# Altium schematic sheet POWER_IN.SchDoc
size A4
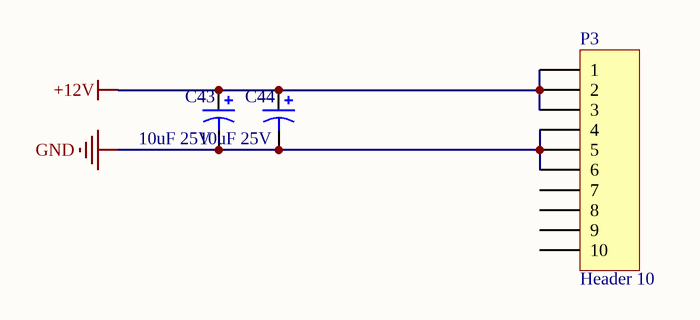
[diagram p0: POWER_IN.SchDoc]

## Parts
C43  value 10uF 25V  [470UF_16V]  (hidden comment: Cap Pol1)
C44  value 10uF 25V  [470UF_16V]  (hidden comment: Cap Pol1)
P3  Header 10  [CON_MOL_5569_6P]

## Nets
+12V: C43.1 C44.1 P3.1 P3.2 P3.3
GND: C43.2 C44.2 P3.4 P3.5 P3.6

Not connected (* = marked no-connect by the designer): P3 7 8 9 10

## Library data of the parts
C43 C44 = Cap Pol1: Polarized Capacitor (Radial); Published: 8-Jun-2000; LatestRevisionDate: 17-Jul-2002; LatestRevisionNote: Re-released for DXP Platform.; PackageReference: RB7.6-15; Publisher: Altium Limited; PackageDescription: Polarized Capacitor (Radial); 2 Leads
P3 = Header 10: Header, 10-Pin; LatestRevisionDate: 17-Jul-2002; LatestRevisionNote: Re-released for DXP Platform.; Publisher: Altium Limited